# Altium schematic sheet Wireless.SchDoc
size A
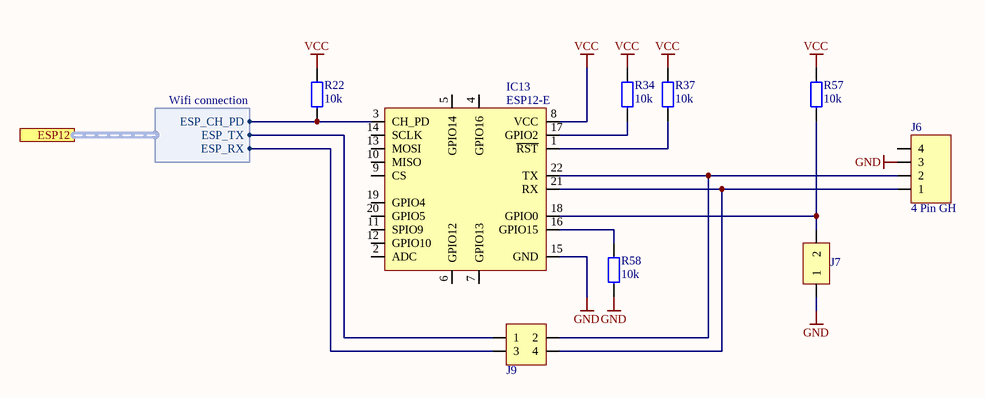
[diagram p0: Wireless.SchDoc]

## Parts
IC13  ESP12-E  [ESP8266 ESP-12-E]
J6  4 Pin GH  [BM04B]
J7  2 pin  [Harwin vertical smt header - single]  (value not drawn)
J9  4 pin  [Harwin vertical smt header - double]  (value not drawn)
R22  10k  [RES 0603]
R34  10k  [RES 0603]
R37  10k  [RES 0603]
R57  10k  [RES 0603]
R58  10k  [RES 0603]

## Ports
ESP12 (harness Wifi connection)

## Harnesses
Wifi connection: ESP_CH_PD, ESP_TX, ESP_RX

## Nets
GND: IC13.15(GND) J6.3 J7.1 R58.1
VCC: IC13.8(VCC) R22.2 R34.2 R37.2 R57.2
NetIC13_1: IC13.1(~{RST}) R37.1
NetIC13_3: IC13.3(CH_PD) R22.1 ; port ESP12.ESP_CH_PD
NetIC13_16: IC13.16(GPIO15) R58.2
NetIC13_17: IC13.17(GPIO2) R34.1
NetIC13_18: IC13.18(GPIO0) J7.2 R57.1
NetIC13_21: IC13.21(RX) J6.1 J9.4
NetIC13_22: IC13.22(TX) J6.2 J9.2
NetJ9_1: J9.1 ; port ESP12.ESP_TX
NetJ9_3: J9.3 ; port ESP12.ESP_RX

Not connected (* = marked no-connect by the designer): IC13 2(ADC) 4(GPIO16) 5(GPIO14) 6(GPIO12) 7(GPIO13) 9(CS) 10(MISO) 11(SPIO9) 12(GPIO10) 13(MOSI) 14(SCLK) 19(GPIO4) 20(GPIO5); J6 4

## Library data of the parts
IC13 = ESP-12E: Wifi module, esp12-e, based on ESP8266 chip
J6 = 4 Pin GH: Złącze GH, męskie, proste, 4 piny, SMD
J7 = harvin vertical smt header - single: 2 pin vertical connection smt harvin
J9 = harvin vertical smt header - double: 4 pin vertical connection smt harvin
R22 R34 R37 R57 R58 = Resistor: SMDResistor; Value: 10k